# Altium project SensorShield.PrjPcb
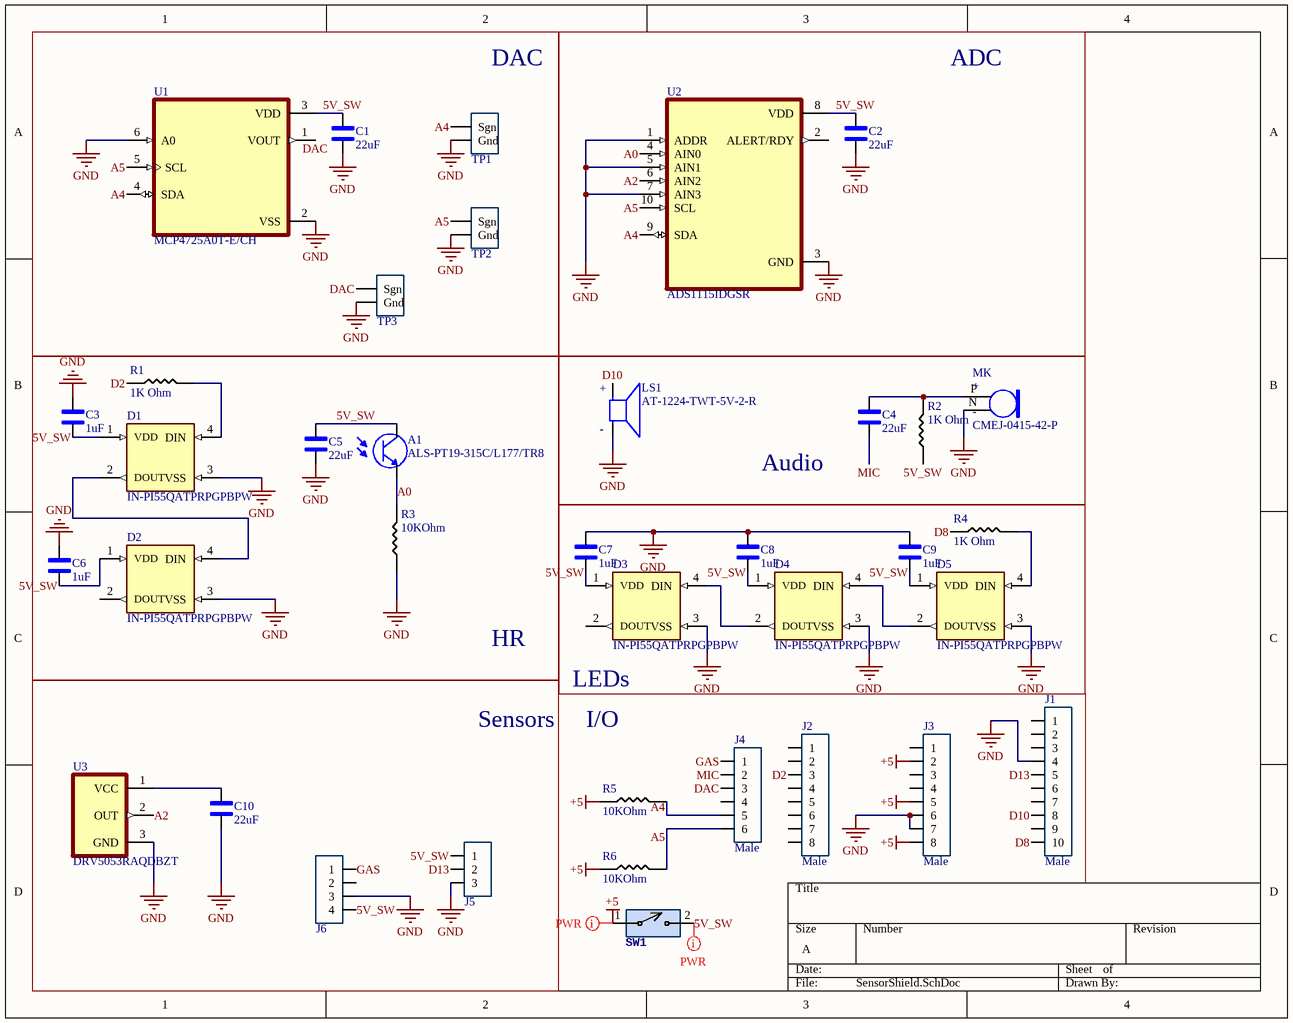
[diagram p0: SensorShield.SchDoc]
1 sheet, 37 parts. Net scope: global (net labels, ports and power ports of the same name join across sheets).
Board file: ECEN4730_SS_2021-11-10.PcbDoc

## Sheet SensorShield.SchDoc
size A; SheetNumber: 1; SheetTotal: 1

### Parts
A1  ALS-PT19-315C/L177/TR8  [XDCR_ALS-PT19-315C/L177/TR8]
C1  22uF  [1206_Passive_Capacitor]
C2  22uF  [1206_Passive_Capacitor]
C3  1uF  [1206_Passive_Capacitor]
C4  22uF  [1206_Passive_Capacitor]
C5  22uF  [1206_Passive_Capacitor]
C6  1uF  [1206_Passive_Capacitor]
C7  1uF  [1206_Passive_Capacitor]
C8  1uF  [1206_Passive_Capacitor]
C9  1uF  [1206_Passive_Capacitor]
C10  22uF  [1206_Passive_Capacitor]
D1  IN-PI55QATPRPGPBPW  [SERIAL_LED]
D2  IN-PI55QATPRPGPBPW  [SERIAL_LED]
D3  IN-PI55QATPRPGPBPW  [SERIAL_LED]
D4  IN-PI55QATPRPGPBPW  [SERIAL_LED]
D5  IN-PI55QATPRPGPBPW  [SERIAL_LED]
J1  value Male  [10_PIN_100MIL]  (hidden comment: PPTC101LFBN-RC)
J2  value Male  [8_PIN_100MIL]  (hidden comment: PPTC081LFBN-RC)
J3  value Male  [8_PIN_100MIL]  (hidden comment: PPTC081LFBN-RC)
J4  value Male  [6_PIN_100MIL]  (hidden comment: PPTC061LFBN-RC)
J5  J_3_PIN_HEADER  [3_PIN_100mil]  (value not drawn)
J6  J_4_PIN_HEADER  [4_PIN_100MIL]  (value not drawn)
LS1  AT-1224-TWT-5V-2-R  [XDCR_AT-1224-TWT-5V-2-R]
MK  CMEJ-0415-42-P  [MIC_CMEJ-0415-42-P]
R1  value 1K Ohm  [1206_Passive_Resitor]  (hidden comment: 1k)
R2  value 1K Ohm  [1206_Passive_Resitor]  (hidden comment: 1k)
R3  value 10KOhm  [1206_Passive_Resitor]  (hidden comment: 10k)
R4  value 1K Ohm  [1206_Passive_Resitor]  (hidden comment: 1k)
R5  value 10KOhm  [1206_Passive_Resitor]  (hidden comment: 10k)
R6  value 10KOhm  [1206_Passive_Resitor]  (hidden comment: 10k)
SW1  SW_2Pin_100mil_Switch  [2Pin-Header-Conn]  (value not drawn)
TP1  10x Probe TP  [TP10x_Probe]  (value not drawn)
TP2  10x Probe TP  [TP10x_Probe]  (value not drawn)
TP3  10x Probe TP  [TP10x_Probe]  (value not drawn)
U1  MCP4725A0T-E/CH  [SOT95P270X145-6N]
U2  ADS1115IDGSR  [SOP50P490X110-10N]
U3  DRV5053RAQDBZT  [SOT95P237X112-3N]

### Blocks framed on the sheet
DAC: C1 TP1-TP3 U1
ADC: C2 U2
HR: A1 C3 C5 C6 D1 D2 R1 R3
Audio: C4 LS1 MK R2
LEDs: C7-C9 D3-D5 R4
Sensors: C10 J5 J6 U3

### Nets
+5: J3.2 J3.5 J3.8 R5.1 R6.1 SW1.1
GND: C1.1 C2.1 C3.2 C5.1 C6.2 C7.2 C8.2 C9.2 C10.1 D1.3(VSS) D2.3(VSS) D3.3(VSS) D4.3(VSS) D5.3(VSS) J1.4 J3.6 J3.7 J5.3 J6.3 LS1.N MK.N(GND) R3.1 TP1.2(Gnd) TP2.2(Gnd) TP3.2(Gnd) U1.2(VSS) U1.6(A0) U2.1(ADDR) U2.3(GND) U2.5(AIN1) U2.7(AIN3) U3.3(GND)
5V_SW: A1.1(C) C1.2 C2.2 C3.1 C5.2 C6.1 C7.1 C8.1 C9.1 D1.1(VDD) D2.1(VDD) D3.1(VDD) D4.1(VDD) D5.1(VDD) J5.1 J6.4 R2.1 SW1.2 U1.3(VDD) U2.8(VDD)
A0: A1.2(E) R3.2 U2.4(AIN0)
A2: U2.6(AIN2) U3.2(OUT)
A4: J4.5 R5.2 TP1.1(Sgn) U1.4(SDA) U2.9(SDA)
A5: J4.6 R6.2 TP2.1(Sgn) U1.5(SCL) U2.10(SCL)
D2: J2.3 R1.1
D8: J1.10 R4.1
D10: J1.8 LS1.P
D13: J1.5 J5.2
DAC: J4.3 TP3.1(Sgn) U1.1(VOUT)
GAS: J4.1 J6.1
MIC: C4.1 J4.2
NetC4_2: C4.2 MK.P(OUTPUT) R2.2
NetC10_2: C10.2 U3.1(VCC)
NetD1_2: D1.2(DOUT) D2.4(DIN)
NetD1_4: D1.4(DIN) R1.2
NetD3_4: D3.4(DIN) D4.2(DOUT)
NetD4_4: D4.4(DIN) D5.2(DOUT)
NetD5_4: D5.4(DIN) R4.2

Not connected (* = marked no-connect by the designer): D2 2(DOUT); D3 2(DOUT); J1 1 2 3 6 7 9; J2 1 2 4 5 6 7 8; J3 1 3 4; J4 4; J6 2; U2 2(ALERT/RDY)

### Layout directives
rule Width Constraint [Pref Width = 20mil    Min Width = 6mil    Max Width = 10mil]: +5
rule Width Constraint [Pref Width = 20mil    Min Width = 6mil    Max Width = 100mil]: 5V_SW

### Notes on the sheet
- I/O
- (in symbol AT-1224-TWT-5V-2-R) +; -
- (in symbol CMEJ-0415-42-P) +; -

### Library data of the parts
A1 = ALS-PT19-315C/L177/TR8: Phototransistors 630nm 2-SMD, No Lead; MF: Everlight; Availability: Good; Check_prices: https://www.snapeda.com/parts/ALS-PT19-315C/L177/TR8/Everlight%20Electronics%20Co%20Ltd/view-part/226235/?ref=eda; SnapEDA_Link: https://www.snapeda.com/parts/ALS-PT19-315C/L177/TR8/Everlight%20Electronics%20Co%20Ltd/view-part/226235/?ref=snap; MP: ALS-PT19-315C/L177/TR8; Price: None; Purchase-URL: https://pricing.snapeda.com/search/part/ALS-PT19-315C/L177/TR8/?ref=eda; Package: None; Value: *
C1 C2 C4 C5 C10 = C_22uF_1206: 22µF ±20% 16V Ceramic Capacitor X5R 1206 (3216 Metric); MFR Part #: CL31A226KPHNNNE; Type: Extended; Digikey Link: https://www.digikey.com/product-detail/en/CL31A226MOCLNNC/1276-2728-1-ND/3890814/?itemSeq=304982363; Digikey Part: 1276-2728-1-ND; Value: 22uF
C3 C6-C9 = C_1uF_1206: 1µF ±20% 16V Ceramic Capacitor X7R 1206 (3216 Metric); MFR Part #: CL31B105KBHNNNE; Type: Basic; Digikey Link: https://www.digikey.com/product-detail/en/C1206C105M4RACTU/399-8150-1-ND/3471873/?itemSeq=304982366; Digikey Part: 399-8150-1-ND; Value: 1uF
D1-D5 = LED_Smart_5050: Digital Series Cascade LED; DigiKey: https://www.digikey.com/product-detail/en/inolux/IN-PI55QATPRPGPBPW-60/1830-1209-1-ND/9681289; Parameter 1: *
J1 = JM_10_PIN_MALE: 10 Position Header Connector 0.100" (2.54mm) Through Hole Tin; Digikey Link: https://www.digikey.com/product-detail/en/PPTC101LFBN-RC/S7008-ND/810149/?itemSeq=304982352; Digikey Part: S7008-ND; LCSC Part#: DNP
J2 J3 = JM_8_PIN_MALE: 8 Position Header Connector 0.100" (2.54mm) Through Hole Tin; Digikey Link: https://www.digikey.com/product-detail/en/PPTC081LFBN-RC/S7006-ND/810147/?itemSeq=304982354; Digikey Part: S7006-ND; LCSC Part#: DNP
J4 = JM_6_PIN_MALE: 6 Position Header Connector 0.100" (2.54mm) Through Hole Tin; Digikey Link: https://www.digikey.com/product-detail/en/PPTC061LFBN-RC/S7004-ND/810145/?itemSeq=304982353; Digikey Part: S7004-ND; LCSC Part#: DNP
J5 = J_3_PIN_HEADER: 3 Position Header Connector 0.100" (2.54mm) Through Hole Tin
J6 = J_4_PIN_HEADER: 4 Position Header Connector 0.100" (2.54mm) Through Hole Tin
LS1 = AT-1224-TWT-5V-2-R: AUDIO TRANSDUCER 5 VP-P 87 DB 2400 HZ; MF: PUI Audio,; Check_prices: https://www.snapeda.com/parts/AT-1224-TWT-5V-2-R/PUI%20Audio,%20Inc./view-part/453710/?ref=eda; Purchase-URL: https://pricing.snapeda.com/search/part/AT-1224-TWT-5V-2-R/?ref=eda; SnapEDA_Link: https://www.snapeda.com/parts/AT-1224-TWT-5V-2-R/PUI%20Audio,%20Inc./view-part/453710/?ref=snap; Value: *; MP: AT-1224-TWT-5V-2-R; Package: PUI Audio,; Price: None; Availability: In Stock
MK = CMEJ-0415-42-P: 4.0 Ð¼Ð¼, Ð²ÑÐµÐ½Ð°Ð¿Ñ€Ð°Ð²Ð»ÐµÐ½Ð½Ñ‹Ð¹, Ð¼Ð¾Ð½Ñ‚Ð°Ð¶ Ð½Ð° Ð¿ÐµÑ‡Ð°Ñ‚Ð½Ð¾Ð¹ Ð¿Ð»Ð°Ñ‚Ðµ, 2.0 Ð’ Ð¿Ð¾ÑÑ‚Ð¾ÑÐ½Ð½Ð¾Ð³Ð¾ Ñ‚Ð¾ÐºÐ°, Ð­Ð»ÐµÐºÑ€ÐµÑ‚-ÐºÐ¾Ð½Ð´ÐµÐ½ÑÐ°Ñ‚Ð¾Ñ€Ð½Ñ‹Ð¹ Ð¼Ð¸ÐºÑ€Ð¾Ñ„Ð¾Ð½; MF: CUI Devices; Digi-Key_Part_Number: 102-6542-ND; Package: CUI Inc.; CUI_purchase_URL: https://www.cuidevices.com/product/audio/microphones/electret-condenser-microphones/cmej-0415-42-p?utm_source=snapeda.com&utm_medium=referral&utm_campaign=snapedaBOM; MP: CMEJ-0415-42-P; Digi-Key_Purchase_URL: https://www.digikey.com/product-detail/en/cui-devices/CMEJ-0415-42-P/102-6542-ND/10253451?utm_source=snapeda&utm_medium=aggregator&utm_campaign=symbol; SnapEDA_Link: https://www.snapeda.com/parts/CMEJ-0415-42-P/CUI%20Devices/view-part/3625885/?ref=snap; Value: *
R1 R2 R4 = R_1K_1206: 1 kOhms ±1% 0.5W, 1/2W Chip Resistor 1206 (3216 Metric) Anti-Sulfur, Moisture Resistant Thin Film; MFR Part #: 1206W4F1001T5; Digikey Link: https://www.digikey.com/product-detail/en/RNCP1206FTD1K00/RNCP1206FTD1K00CT-ND/2240675/?itemSeq=304982373; Digikey Part: RNCP1206FTD1K00CT-ND
R3 R5 R6 = R_10KOhm_1206: 10 kOhms ±5% 0.25W, 1/4W Chip Resistor 1206 (3216 Metric) Automotive AEC-Q200 Thick Film; Digikey Link: https://www.digikey.com/product-detail/en/RMCF1206JT300R/RMCF1206JT300RCT-ND/1942776/?itemSeq=304982374; Digikey Part: RMCF1206JT300RCT-ND
SW1 = SW_2Pin_100mil_Switch: 2Pin Header; LCSC Part#: C124375; Type: Extended
TP1-TP3 = TP_10x_Probe: Test Point 300 mil centers
U1 = MCP4725A0T-E/CH: 12 Bit Digital to Analog Converter 1 SOT-23-6; MF: Microchip; Package: SOT-23-6 Microchip; Value: *; Availability: Unavailable; SnapEDA_Link: https://www.snapeda.com/parts/MCP4725A0T-E/CH/Microchip/view-part/109888/?ref=snap; Price: None; MP: MCP4725A0T-E/CH
U2 = ADS1115IDGSR: 16-Bit 860SPS 4-Ch Delta-Sigma ADC With PGA, Oscillator, Vref, Comparator, and I2C 10-VSSOP -40 to 125; MF: Texas Instruments; SnapEDA_Link: https://www.snapeda.com/parts/ADS1115IDGSR/Texas%20Instruments/view-part/45903/?ref=snap; Value: *; Texas_Instruments-Purchase-URL: https://snapeda.com/shop?store=Texas+Instruments&id=45903; Price: None; Availability: Good; Mouser-Purchase-URL: https://snapeda.com/shop?store=Mouser&id=45903; MP: ADS1115IDGSR; Package: VSSOP-10 Texas Instruments; DigiKey-Purchase-URL: https://snapeda.com/shop?store=DigiKey&id=45903; BuyPart: https://www.snapeda.com/parts/ADS1115IDGSR/Texas%20Instruments/view-part/45903/?ref=eda
U3 = DRV5053RAQDBZT: SENSOR LINEAR ANALOG SOT23-3; Package: None; Price: None; Value: *; MP: DRV5053RAQDBZT; Availability: Unavailable